# Altium schematic sheet pca20020_sheet9_interface.SchDoc: PCA20020 - Interface
size A4; Organization: Nordic Semiconductor; DocumentNumber: 9; SheetNumber: 9; SheetTotal: 9; CompanyName: Nordic Semiconductor; DocumentSize: A4
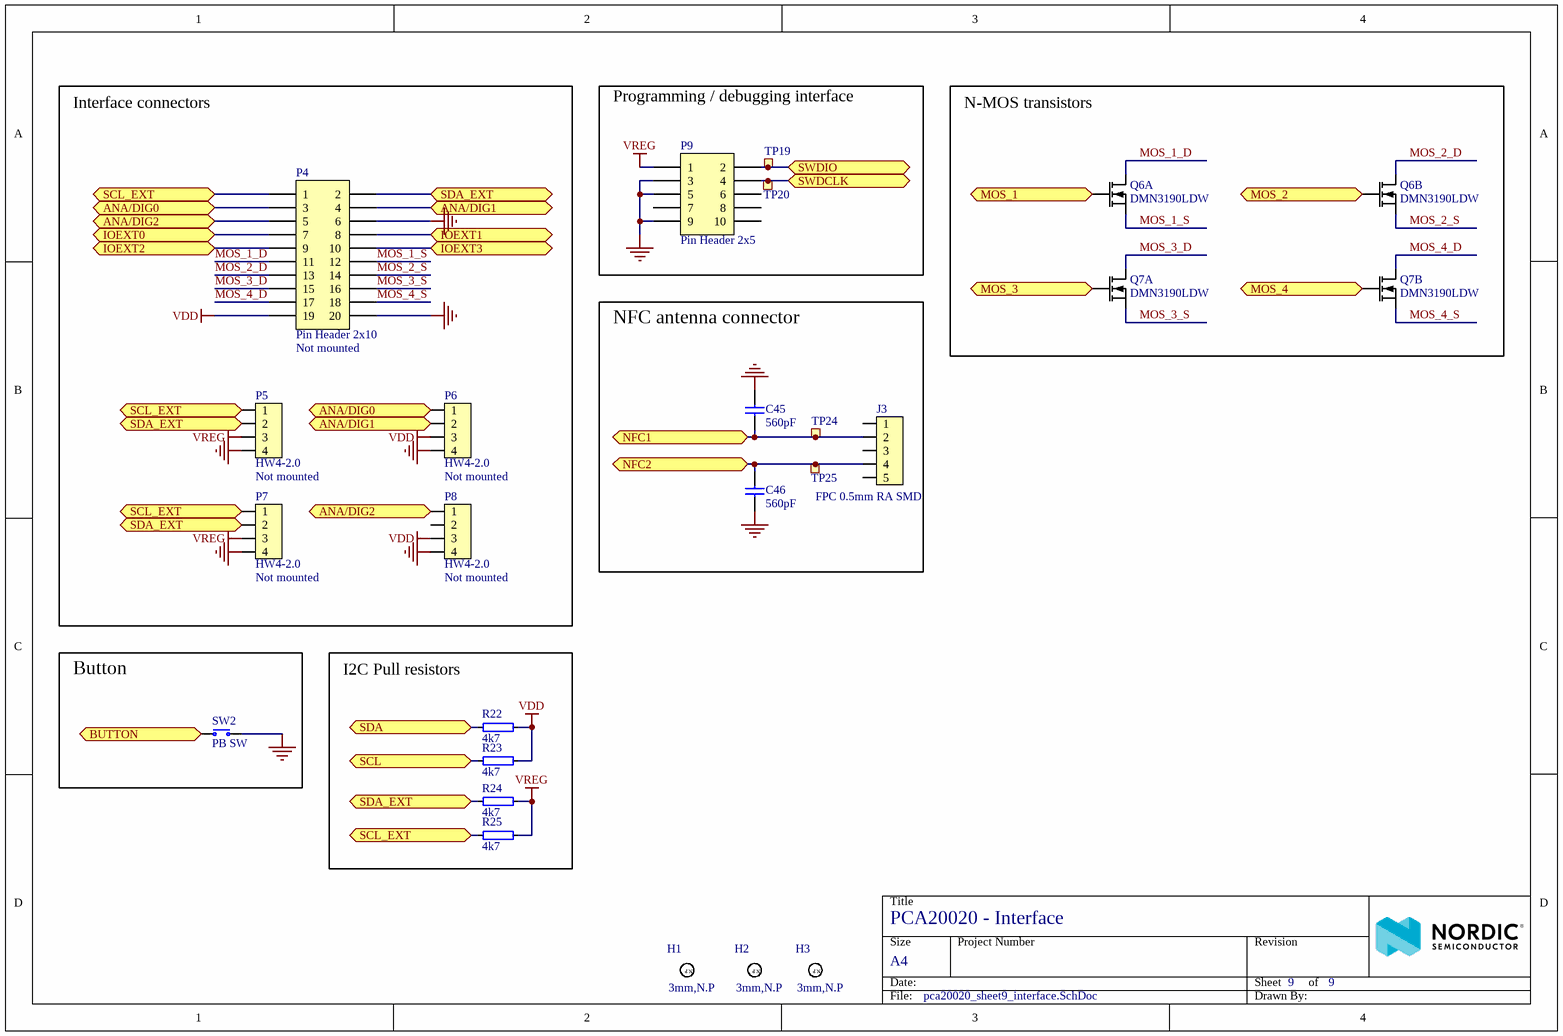
[diagram p0: pca20020_sheet9_interface.SchDoc]

## Parts
C45  560pF  [CAPC1005X04L]
C46  560pF  [CAPC1005X04L]
H1  3mm,N.P  [HOLE_NP_3MM]  (no BOM)
H2  3mm,N.P  [HOLE_NP_3MM]  (no BOM)
H3  3mm,N.P  [HOLE_NP_3MM]  (no BOM)
J3  FPC 0.5mm RA SMD  [FPC_05P-0.5mm-RA-SMD]
P4  Pin Header 2x10  Assembly: Not mounted  [HDR_2x10-NC]
P5  HW4-2.0  Assembly: Not mounted  [TAIFENG_HW4-2.0-NC]
P6  HW4-2.0  Assembly: Not mounted  [TAIFENG_HW4-2.0-NC]
P7  HW4-2.0  Assembly: Not mounted  [TAIFENG_HW4-2.0-NC]
P8  HW4-2.0  Assembly: Not mounted  [TAIFENG_HW4-2.0-NC]
P9  Pin Header 2x5  [HDR_2x5-SMD-1.27mm-ANG]
Q6  DMN3190LDW  [SOT-363]  (parts A,B of 2)
Q7  DMN3190LDW  [SOT-363]  (parts A,B of 2)
R22  4k7  [RESC1005X04L]
R23  4k7  [RESC1005X04L]
R24  4k7  [RESC1005X04L]
R25  4k7  [RESC1005X04L]
SW2  PB SW  [Switch-PB-6.2x6.3mm-SMD]
TP19  Ø1.5mm,SMD  [TP_SMD_Ø1.5mm]  (value not drawn)  (no BOM)
TP20  Ø1.5mm,SMD  [TP_SMD_Ø1.5mm]  (value not drawn)  (no BOM)
TP24  Ø1.0mm,SMD  [TP_SMD_Ø1.0mm]  (value not drawn)  (no BOM)
TP25  Ø1.0mm,SMD  [TP_SMD_Ø1.0mm]  (value not drawn)  (no BOM)

## Blocks framed on the sheet
Interface connectors: P4-P8
Programming / debugging interface: P9 TP19 TP20
N-MOS transistors: Q6 Q7
NFC antenna connector: C45 C46 J3 TP24 TP25
Button: SW2
I2C Pull resistors: R22-R25

## Ports
ANA/DIG0 (bidir), ANA/DIG1 (bidir), ANA/DIG2 (bidir), BUTTON (bidir), IOEXT0 (bidir), IOEXT1 (bidir), IOEXT2 (bidir), IOEXT3 (bidir), MOS_1 (bidir), MOS_2 (bidir), MOS_3 (bidir), MOS_4 (bidir), NFC1 (bidir), NFC2 (bidir), SCL (bidir), SCL_EXT (bidir), SDA (bidir), SDA_EXT (bidir), SWDCLK (bidir), SWDIO (bidir)

## Nets
GND: C45.2 C46.1 P4.6 P4.20 P5.4 P6.4 P7.4 P8.4 P9.3 P9.5 P9.9 SW2.1(N.O)
VDD: P4.19 P6.3 P8.3 R22.1 R23.1
VREG: P5.3 P7.3 P9.1 R24.1 R25.1
ANA/DIG0: P4.3 P6.1 ; port ANA/DIG0
ANA/DIG1: P4.4 P6.2 ; port ANA/DIG1
ANA/DIG2: P4.5 P8.1 ; port ANA/DIG2
BUTTON: SW2.2(COM) ; port BUTTON
IOEXT0: P4.7 ; port IOEXT0
IOEXT1: P4.8 ; port IOEXT1
IOEXT2: P4.9 ; port IOEXT2
IOEXT3: P4.10 ; port IOEXT3
MOS_1: Q6.2(G1) ; port MOS_1
MOS_1_D: P4.11 Q6.6(D1)
MOS_1_S: P4.12 Q6.1(S1)
MOS_2: Q6.5(G2) ; port MOS_2
MOS_2_D: P4.13 Q6.3(D2)
MOS_2_S: P4.14 Q6.4(S2)
MOS_3: Q7.2(G1) ; port MOS_3
MOS_3_D: P4.15 Q7.6(D1)
MOS_3_S: P4.16 Q7.1(S1)
MOS_4: Q7.5(G2) ; port MOS_4
MOS_4_D: P4.17 Q7.3(D2)
MOS_4_S: P4.18 Q7.4(S2)
NFC1: C45.1 J3.2 TP24.1 ; port NFC1
NFC2: C46.2 J3.4 TP25.1 ; port NFC2
SCL: R23.2 ; port SCL
SCL_EXT: P4.1 P5.1 P7.1 R25.2 ; port SCL_EXT
SDA: R22.2 ; port SDA
SDA_EXT: P4.2 P5.2 P7.2 R24.2 ; port SDA_EXT
SWDCLK: P9.4 TP20.1 ; port SWDCLK
SWDIO: P9.2 TP19.1 ; port SWDIO

Not connected (* = marked no-connect by the designer): H1 1; H2 1; H3 1; J3 1 3 5; P8 2; P9 6 7 8 10

## Notes on the sheet
- Title
- Size
- Date:
- A4
- Project Number
- Sheet         of
- Revision
- File:
- Drawn By:
- (in symbol Hole_3MM_NP) N.P

## Library data of the parts
C45 C46 = C0402-560p: Capacitor, NP0, ±5%; Part number IPS: N.A.; Note: 50V; Artikkelnr Noca: 20029161; Part Number: C0402-560p; Manufacturer: *; Manufacturer Part Number: *; Footprint Doc: 0402; LatestRevisionDate: 2009-05-08; Pin Count: 2; Publisher: Nordic Semiconductor; Published: 2009-05-08; Value: 560pF; ComponentLink1URL: *; ComponentLink1Description: Datasheet; ComponentLink2URL: *; ComponentLink2Description: Supplier link; HelpURL: *; Supplier 1: *; Supplier Part Number 1: *; Supplier 2: *; Supplier Part Number 2: *
H1-H3 = Hole_3MM_NP: Regular Non-Plated, 3mm hole; Manufacturer: Nordic Semiconductor; Artikkelnr Noca: N.A.; Part Number: Hole_3MM_NP; Manufacturer Part Number: *; Footprint Doc: Hole_3MM_NP; LatestRevisionDate: 2009-12-12; Pin Count: 1; Publisher: Nordic Semiconductor; Published: 2009-12-12; Value: 3mm,N.P; Note: Regular Non-Plated, 3mm hole; Part number IPS: N.A.; ComponentLink1URL: *; ComponentLink1Description: Datasheet; ComponentLink2URL: *; ComponentLink2Description: Supplier link; HelpURL: *; Supplier 1: *; Supplier Part Number 1: *; Supplier 2: *; Supplier Part Number 2: *
J3 = FPC_05P-0.5mm-RA-SMD: 0.5mm FPC, 5P,Right Angle SMT,Double Contact,H=1.2mm,White, Tin plated; Manufacturer: W-CON; Manufacturer Part Number: 5141-05RZDNWR01; Part number IPS: 00000007792; Artikkelnr Noca: 55010020; Part Number: FPC_05P-0.5mm-RA-SMD; Footprint Doc: FPC_05P-0.5mm-RA-SMD; LatestRevisionDate: 2016-04-21; Pin Count: 7; Publisher: Nordic Semiconductor; Published: 2015-06-22; Value: FPC 0.5mm RA SMD; Note: *; ComponentLink1URL: *; ComponentLink1Description: Datasheet; ComponentLink2URL: *; ComponentLink2Description: Supplier link; HelpURL: \\hizz\pro\app9717\Datasheet\connectores\W-CON\5141-XXRZDNXX0X.pdf; Supplier 1: Cabcon; Supplier Part Number 1: 5141-05RZDNWR01; Supplier 2: Digi-Key; Supplier Part Number 2: WM9836CT-ND
P4 = Pin Header 2x10, N.C.: Pin Header 2x10, 2.54mm (100mil); Artikkelnr Noca: N.A.; Part Number: Pin Header 2x10, N.C.; Manufacturer: *; Manufacturer Part Number: *; Footprint Doc: HDR_2x10; LatestRevisionDate: 2017-02-02; Pin Count: 20; Publisher: Nordic Semiconductor; Published: 2017-01-30; Value: Pin Header 2x10; Note: *; Part number IPS: N.A.; ComponentLink1URL: *; ComponentLink1Description: Datasheet; ComponentLink2URL: *; ComponentLink2Description: Supplier link; HelpURL: *; Supplier 1: *; Supplier Part Number 1: *; Supplier 2: *; Supplier Part Number 2: *
P5-P8 = Taifeng_HW4-2.0, N.C.: 4 pin, Grove DIP connector; Artikkelnr Noca: N.A.; Part Number: Taifeng_HW4-2.0, N.C.; Manufacturer: Taifeng; Manufacturer Part Number: HW4-2.0; Footprint Doc: HW4-2.0; LatestRevisionDate: 2017-01-30; Pin Count: 4; Publisher: Nordic Semiconductor; Published: 2017-01-30; Value: HW4-2.0; Note: *; Part number IPS: N.A.; ComponentLink1URL: *; ComponentLink1Description: Datasheet; ComponentLink2URL: *; ComponentLink2Description: Supplier link; HelpURL: *; Supplier 1: Seeedstudio; Supplier Part Number 1: 110990030; Supplier 2: *; Supplier Part Number 2: *
P9 = Pin Header 2x5 SMD, 1.27mm, Angled: Pin Header 2x5, 1.27mm (50mil); Manufacturer: Samtec; Manufacturer Part Number: FTSH-105-01-L-DH-A-C-TR; Part number IPS: 00000007800; Artikkelnr Noca: N.A.; Part Number: Pin Header 2x5 SMD, 1.27mm, Angled; LatestRevisionDate: 2014-01-22; Pin Count: 10; Publisher: Nordic Semiconductor; Published: 2014-01-22; Value: Pin Header 2x5; Note: *; Footprint Doc: HDR_2x5-SMD-1.27mm-ANG; ComponentLink1URL: *; ComponentLink1Description: Datasheet; ComponentLink2URL: *; ComponentLink2Description: Supplier link; HelpURL: http://www.samtec.com/documents/webfiles/pdf/FTSH_SMT.PDF; Supplier 1: Samtec; Supplier Part Number 1: FTSH-105-01-L-DH-A-C-TR; Supplier 2: *; Supplier Part Number 2: *
Q6 Q7 = DMN3190LDW: Dual N Ch MOFET, 1A, 190mOhm, 320mW; Manufacturer: Diodes Incorporated; Part number IPS: 00000007804; Note: Dual N Channel Digital FET; Artikkelnr Noca: N.A.; Part Number: DMN3190LDW; Manufacturer Part Number: DMN3190LDW; Footprint Doc: SOT-363; LatestRevisionDate: 2016-09-22; Pin Count: 6; Publisher: Nordic Semiconductor; Published: 2016-09-22; Value: DMN3190LDW; Supplier 1: Digi-Key; Supplier Part Number 1: DMN3190LDW-13DICT-ND; Supplier 2: *; Supplier Part Number 2: *; ComponentLink1URL: *; ComponentLink1Description: Datasheet; ComponentLink2URL: *; ComponentLink2Description: Supplier link; HelpURL: http://www.diodes.com/_files/datasheets/DMN3190LDW.pdf
R22-R25 = R0402-4k7: Resistor, ±1%, 0.063W; Part number IPS: 00000003433; Note: Chip Res 1%; Artikkelnr Noca: 27049089; Part Number: R0402-4k7; Manufacturer: *; Manufacturer Part Number: *; Footprint Doc: 0402; LatestRevisionDate: 2009-11-23; Pin Count: 2; Publisher: Nordic Semiconductor; Published: 2009-05-08; Value: 4k7; ComponentLink1URL: *; ComponentLink1Description: Datasheet; ComponentLink2URL: *; ComponentLink2Description: Supplier link; HelpURL: *; Supplier 1: Farnell; Supplier Part Number 1: 173-8858; Supplier 2: *; Supplier Part Number 2: *
SW2 = Switch-PB-6.2x6.3mm-SMD: Tactile Switch, SPNO, SMD, 160gf, 6.2x6.3x2.5mm; Manufacturer: Dailywell; Manufacturer Part Number: TS604VM1-025BR-R; Part number IPS: 00000007812; Artikkelnr Noca: 50019106; Part Number: Switch-PB-6.2x6.3mm-SMD; Footprint Doc: Switch-PB-6.2x6.3mm-SMD; LatestRevisionDate: 2016-04-21; Pin Count: 4; Publisher: Nordic Semiconductor; Published: 2010-02-01; Value: PB SW; Note: *; ComponentLink1URL: *; ComponentLink1Description: Datasheet; ComponentLink2URL: *; ComponentLink2Description: Supplier link; HelpURL: \\hizz\pro\app9717\Datasheet\switches\Dailywell\TS604VM1-025BR-R.pdf; Supplier 1: Cabcon; Supplier Part Number 1: TS604VM1-025BR-R; Supplier 2: Mouser; Supplier Part Number 2: 688-SKHUALE010
TP19 TP20 = TP_SMD_Ø1.5MM: 1.0mm circular SMD testpad; Manufacturer: Nordic Semiconductor; Artikkelnr Noca: N.A.; Part Number: TP_SMD_Ø1.5MM; Manufacturer Part Number: *; Footprint Doc: TP_SMD_Ø1.5mm; LatestRevisionDate: 2016-06-02; Pin Count: 1; Publisher: Nordic Semiconductor; Published: 2016-06-02; Value: Ø1.5mm,SMD; Note: *; Part number IPS: N.A.; ComponentLink1URL: *; ComponentLink1Description: Datasheet; ComponentLink2URL: *; ComponentLink2Description: Supplier link; HelpURL: *; Supplier 1: *; Supplier Part Number 1: *; Supplier 2: *; Supplier Part Number 2: *
TP24 TP25 = TP_SMD_Ø1.0MM: 1.0mm circular SMD testpad; Manufacturer: Nordic Semiconductor; Artikkelnr Noca: N.A.; Part Number: TP_SMD_Ø1.0MM; Manufacturer Part Number: *; Footprint Doc: TP_SMD_Ø1.0mm; LatestRevisionDate: 2013-06-11; Pin Count: 1; Publisher: Nordic Semiconductor; Published: 2013-06-11; Value: Ø1.0mm,SMD; Note: *; Part number IPS: N.A.; ComponentLink1URL: *; ComponentLink1Description: Datasheet; ComponentLink2URL: *; ComponentLink2Description: Supplier link; HelpURL: *; Supplier 1: *; Supplier Part Number 1: *; Supplier 2: *; Supplier Part Number 2: *